# EAGLE schematic 408_jetracer_ledappend_boardRev010100 (EAGLE 9.6.2)
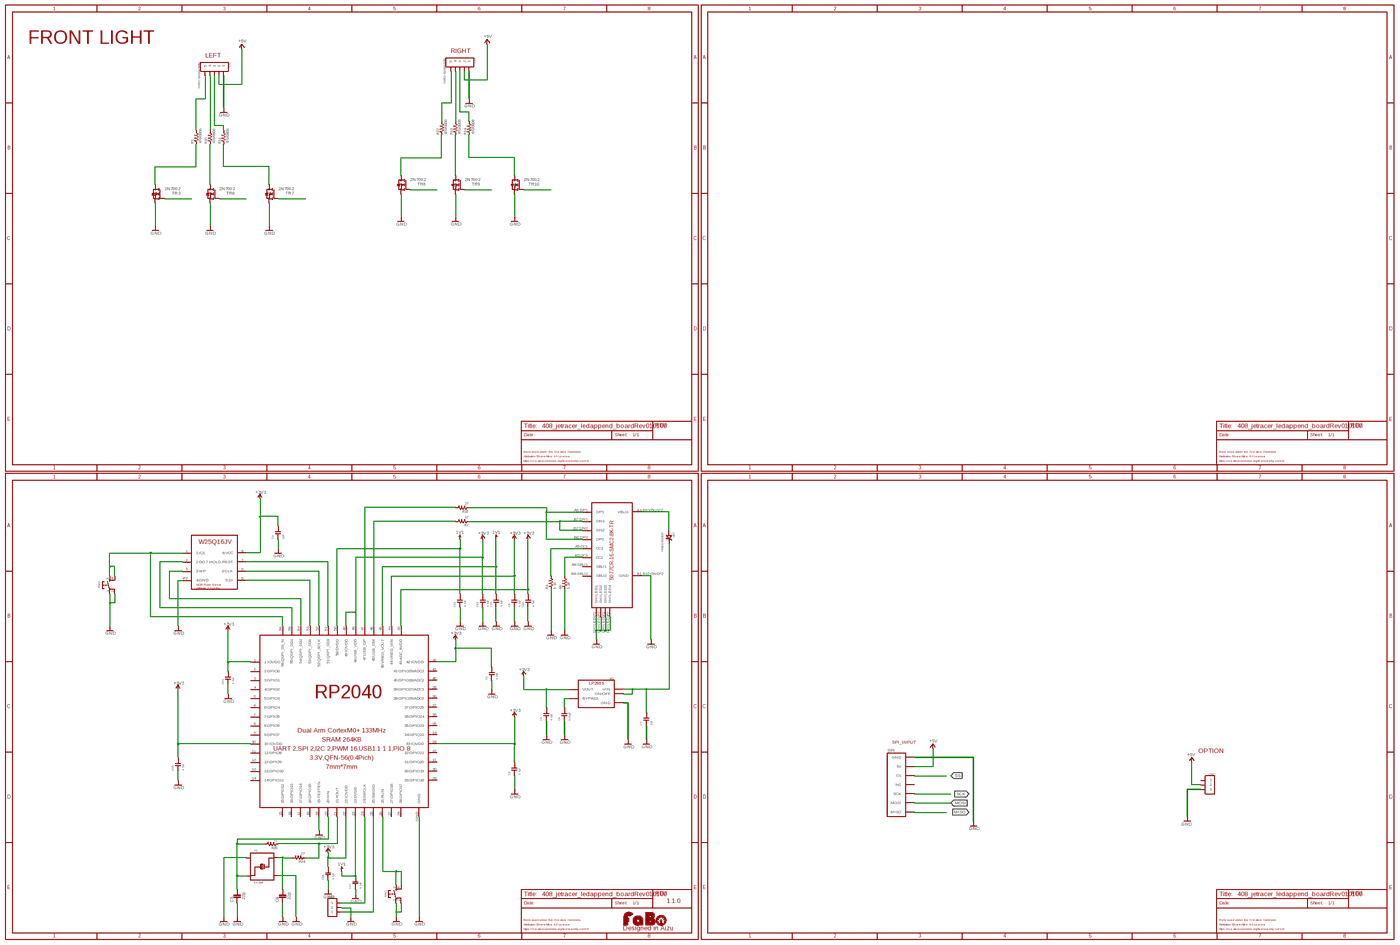
[diagram p0: schematic, sheet 1, overview]
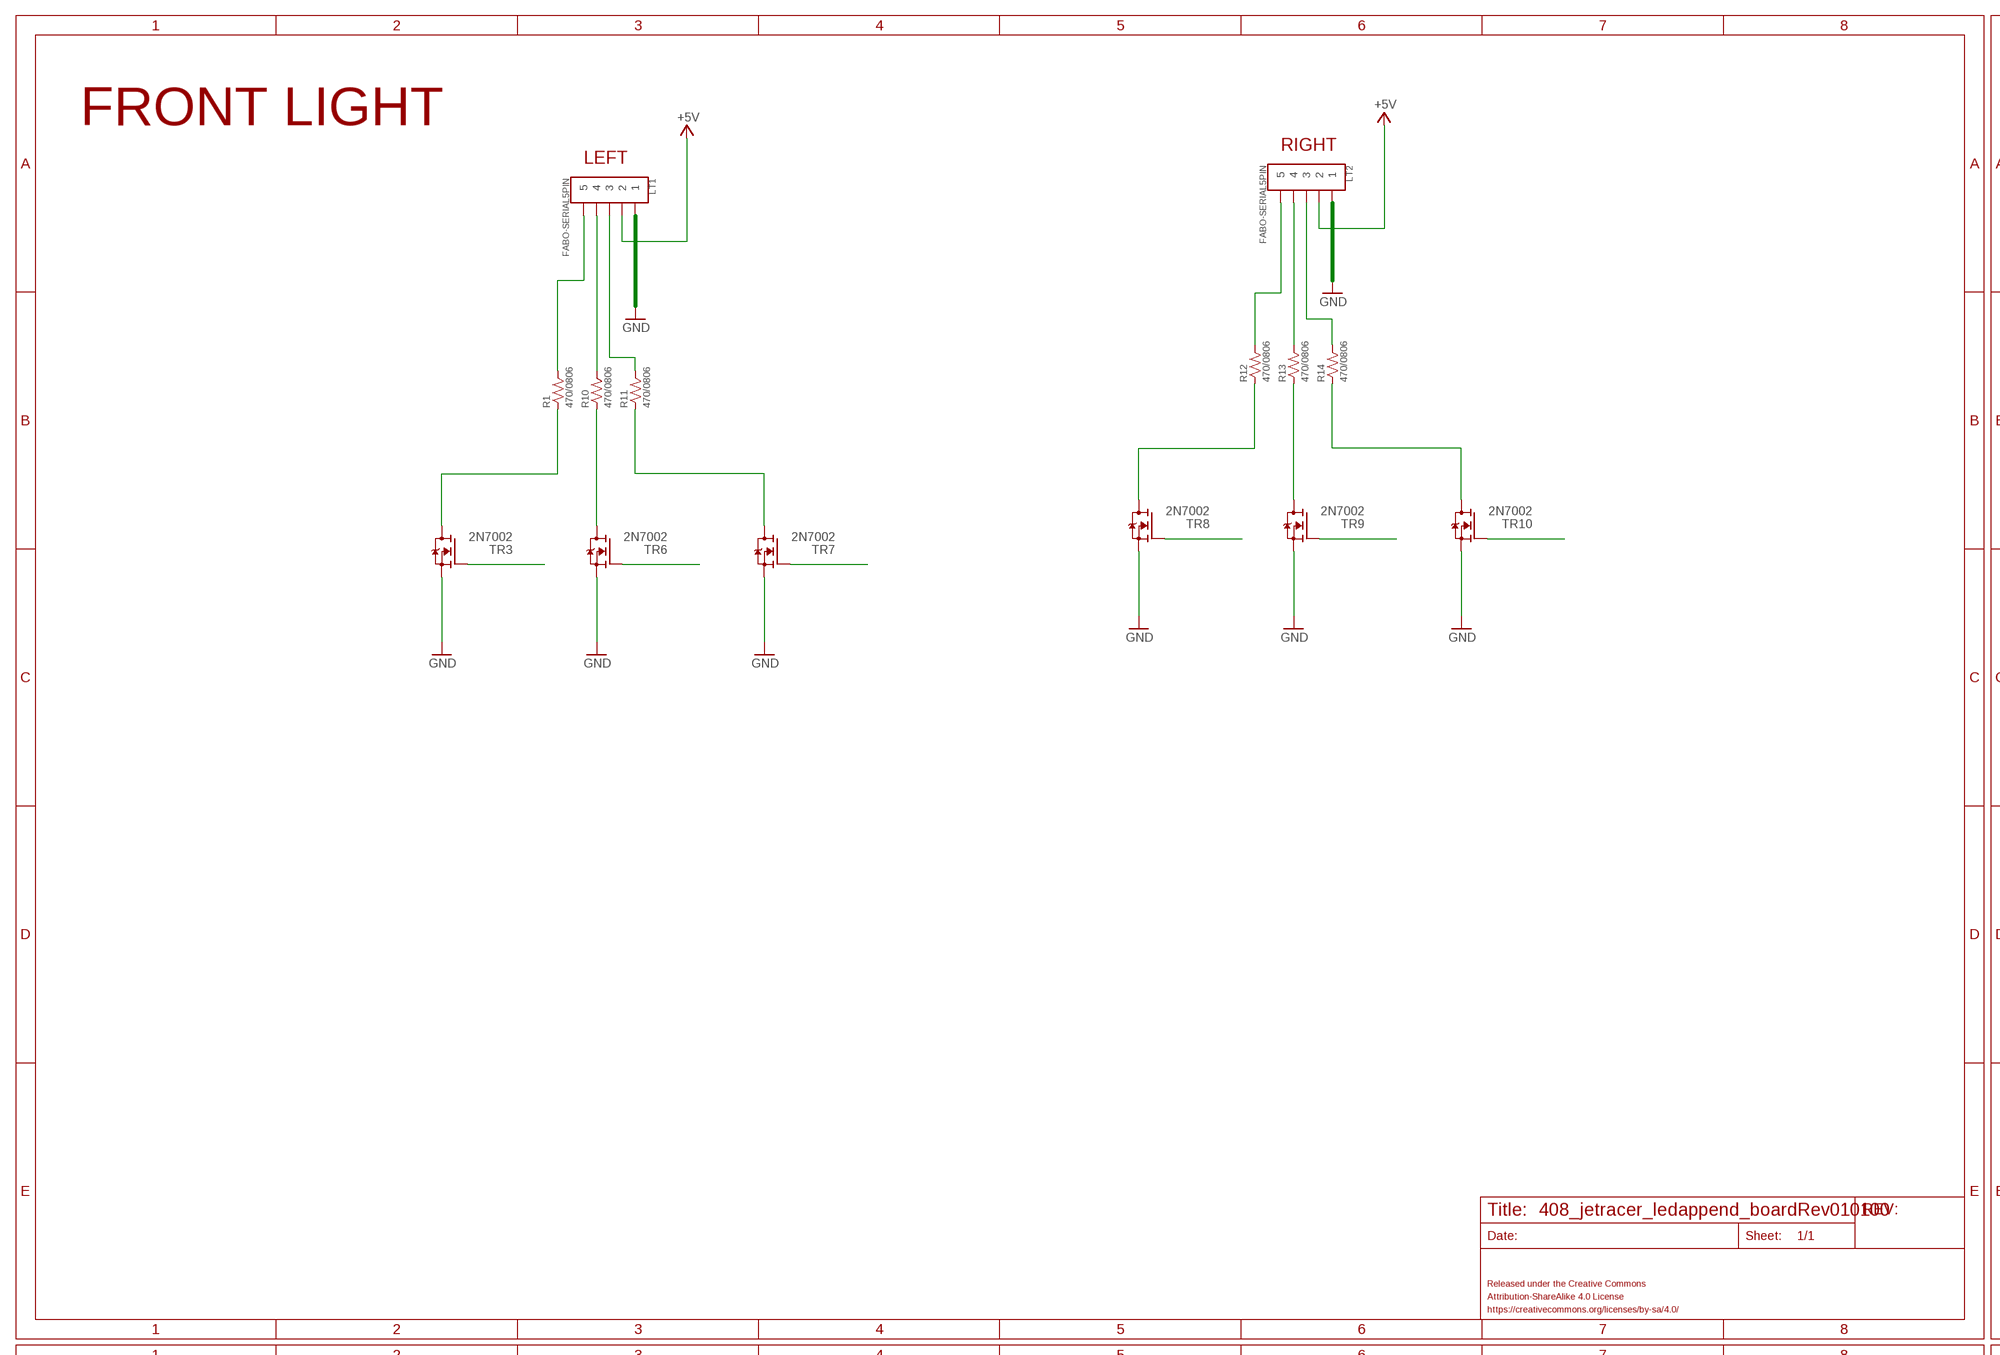
[diagram p1: schematic, sheet 1, part 1 of 4]
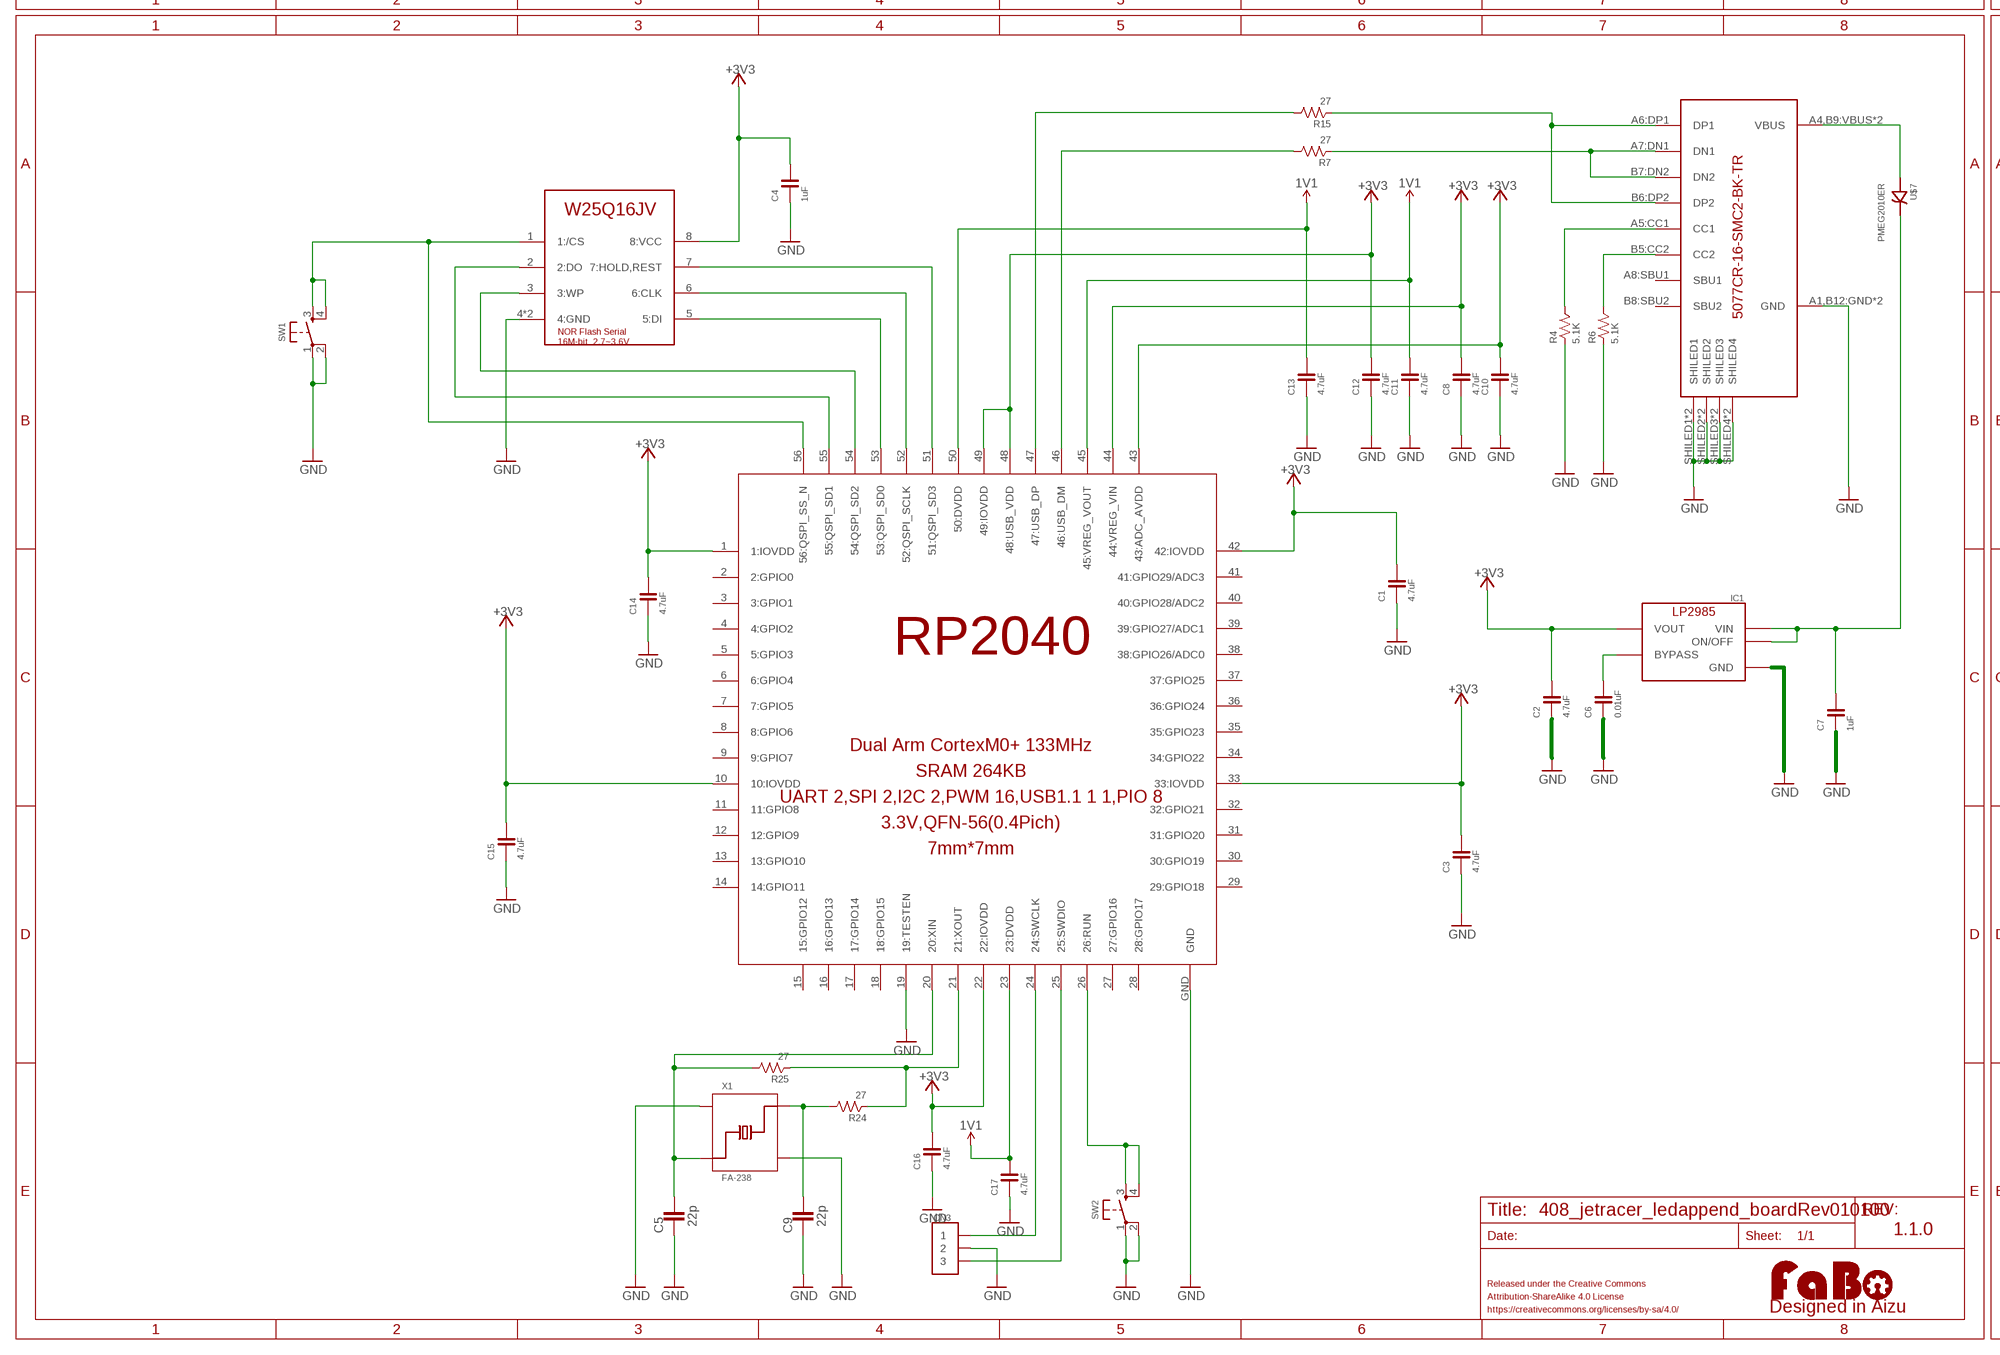
[diagram p2: schematic, sheet 1, part 2 of 4]
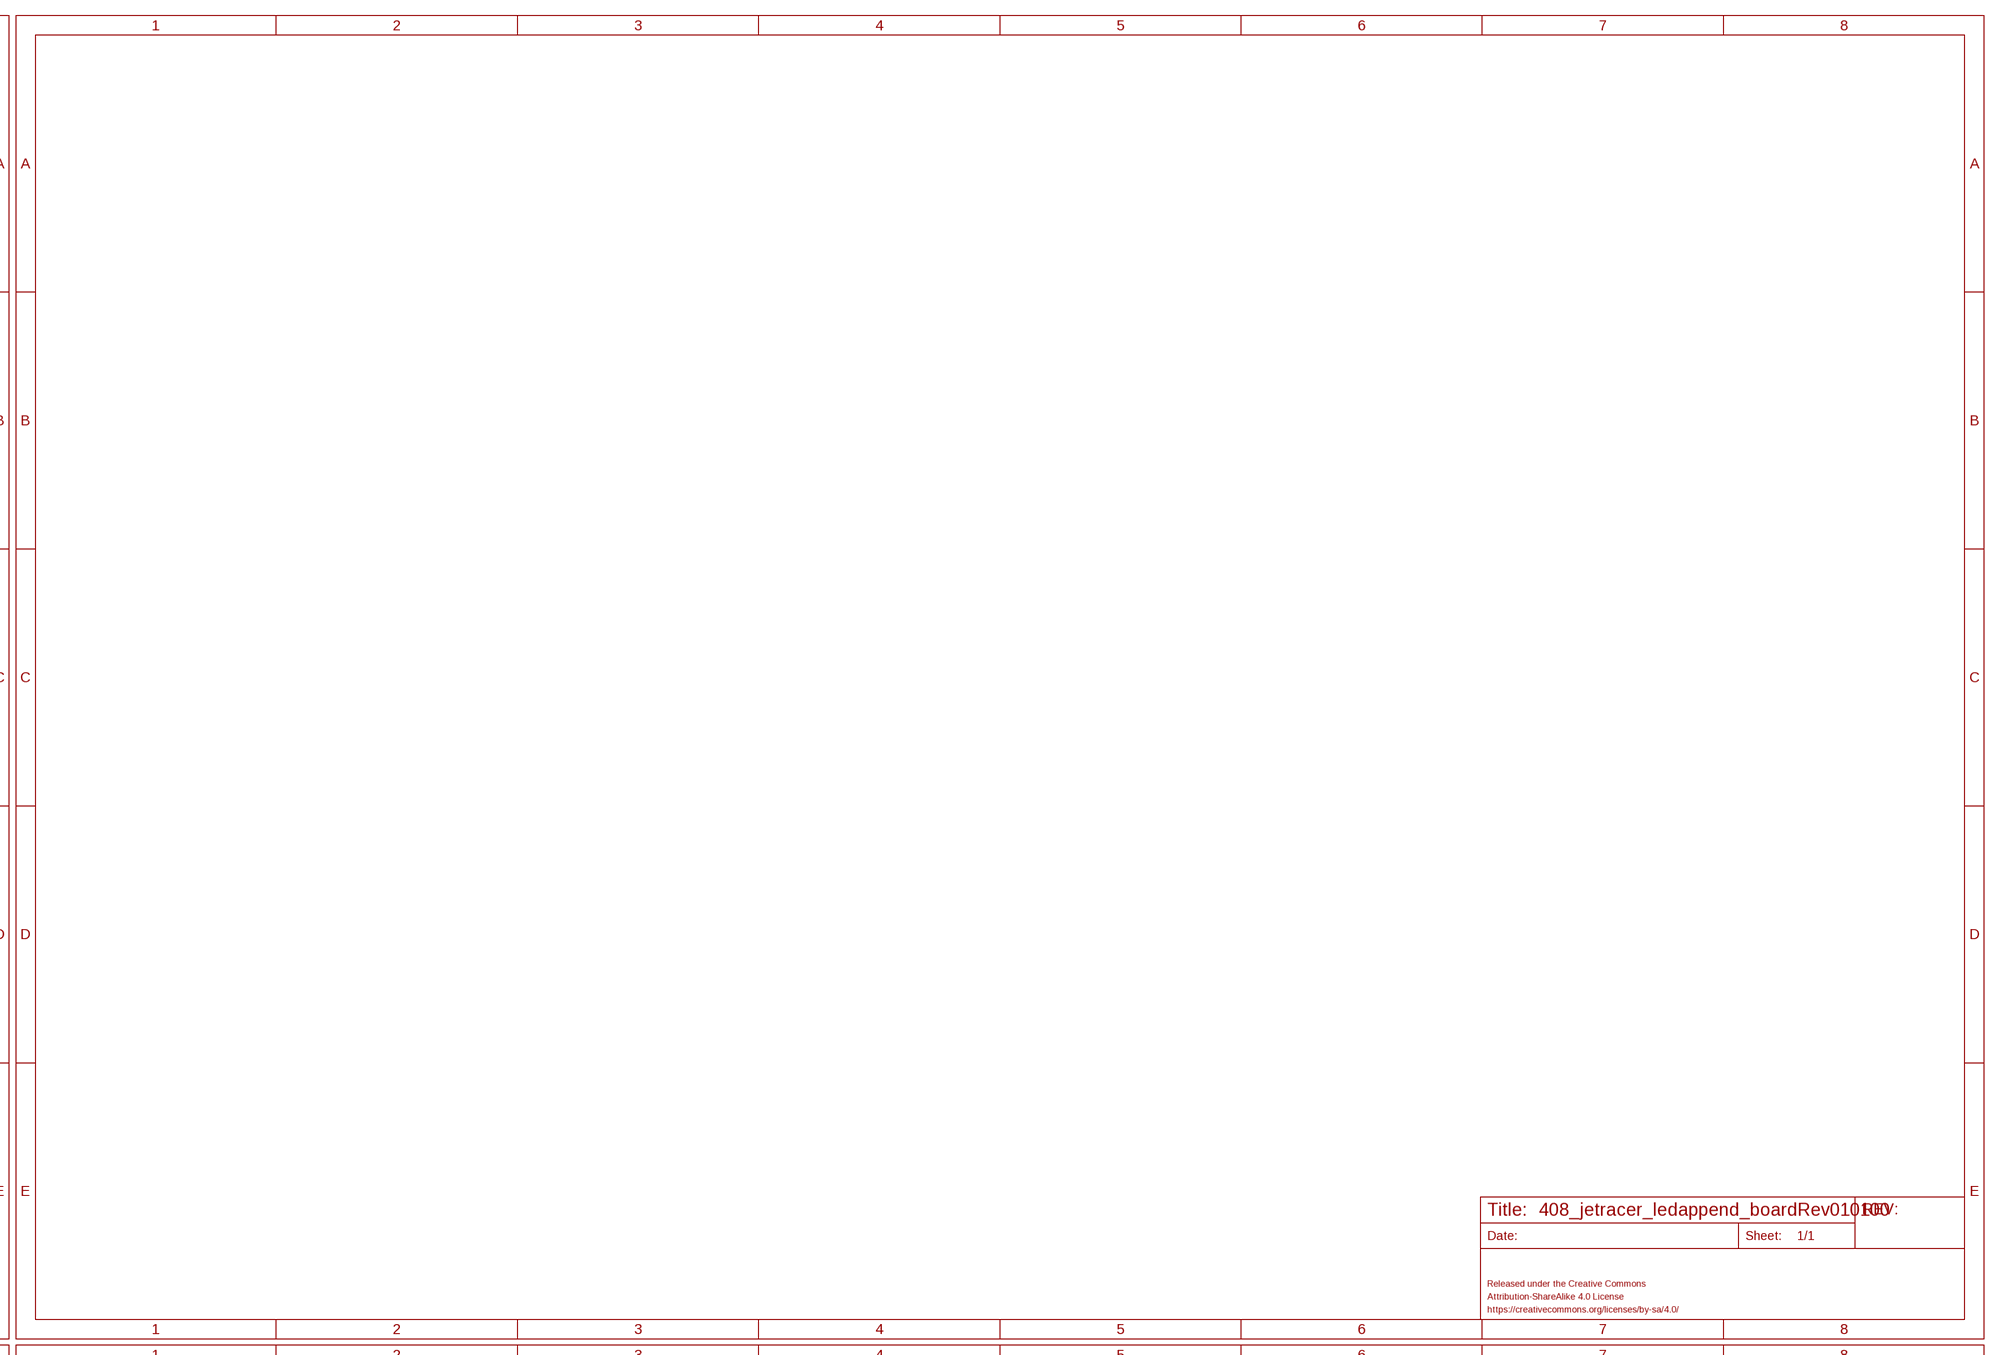
[diagram p3: schematic, sheet 1, part 3 of 4]
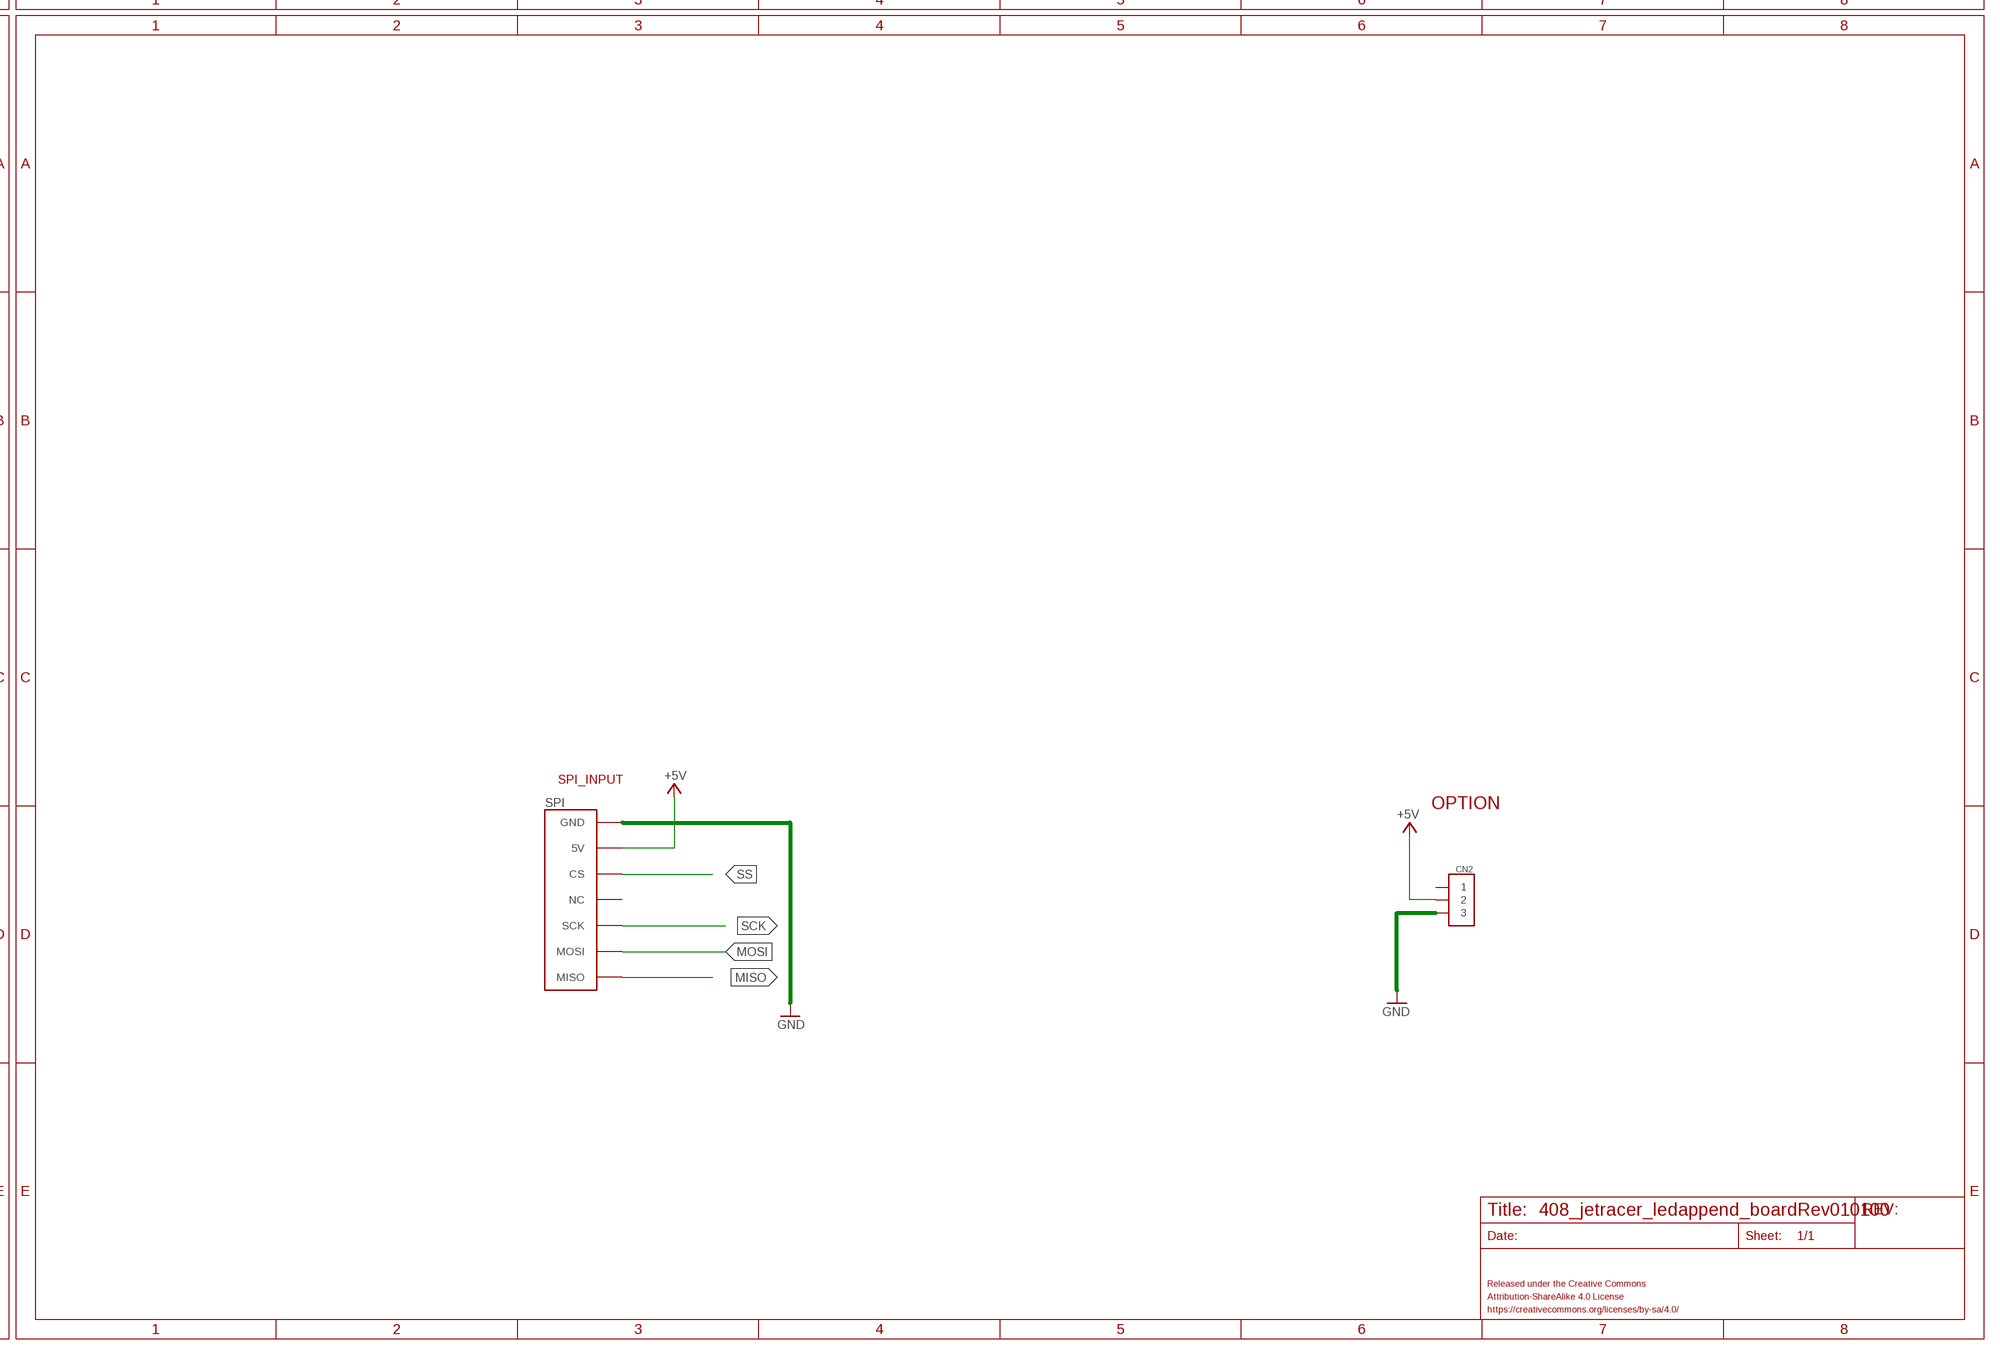
[diagram p4: schematic, sheet 1, part 4 of 4]

## Parts
C1  4.7uF  CAPACITOR-0603  [0603]
C2  4.7uF  CAPACITOR-0603  [0603]
C3  4.7uF  CAPACITOR-0603  [0603]
C4  1uF  CAPACITOR-0603  [0603]
C5  22p  0014_22PF_0603  [C0603-ROUND]
C6  0.01uF  CAPACITOR-0603  [0603]
C7  1uF  CAPACITOR-0603  [0603]
C8  4.7uF  CAPACITOR-0603  [0603]
C9  22p  0014_22PF_0603  [C0603-ROUND]
C10  4.7uF  CAPACITOR-0603  [0603]
C11  4.7uF  CAPACITOR-0603  [0603]
C12  4.7uF  CAPACITOR-0603  [0603]
C13  4.7uF  CAPACITOR-0603  [0603]
C14  4.7uF  CAPACITOR-0603  [0603]
C15  4.7uF  CAPACITOR-0603  [0603]
C16  4.7uF  CAPACITOR-0603  [0603]
C17  4.7uF  CAPACITOR-0603  [0603]
CN2  PIN_1X3  [PIN_1X3]
CN3  PIN_1X3  [PIN_1X3]
IC1  LP2985-33DBV  [SOT-23-5]
LOGO2  LOGO_FABO-M_BOTTOM  [LOGO_FABO_M_BOTTOM]
LT1  FABO-SERIAL5PIN  [BM05B-PASS-1]
LT2  FABO-SERIAL5PIN  [BM05B-PASS-1]
R1  470/0806  RESISTOR-0805  [0805]
R4  5.1K  RESISTOR-0603  [0603]
R6  5.1K  RESISTOR-0603  [0603]
R7  27  RESISTOR-0603  [0603]
R10  470/0806  RESISTOR-0805  [0805]
R11  470/0806  RESISTOR-0805  [0805]
R12  470/0806  RESISTOR-0805  [0805]
R13  470/0806  RESISTOR-0805  [0805]
R14  470/0806  RESISTOR-0805  [0805]
R15  27  RESISTOR-0603  [0603]
R24  27  RESISTOR-0603  [0603]
R25  27  RESISTOR-0603  [0603]
SPI  FABO-7PINMULTI_SPI  [BM07B-PASS-1]
SW1  TACT-SWITCH-SMD_KMR2  [KMR2]
SW2  TACT-SWITCH-SMD_KMR2  [KMR2]
TR3  2N7002  1612_2N7002LT1G  [SOT-23]
TR6  2N7002  1612_2N7002LT1G  [SOT-23]
TR7  2N7002  1612_2N7002LT1G  [SOT-23]
TR8  2N7002  1612_2N7002LT1G  [SOT-23]
TR9  2N7002  1612_2N7002LT1G  [SOT-23]
TR10  2N7002  1612_2N7002LT1G  [SOT-23]
U$2  RP2040  [RP2040]
U$4  W25Q16JVZPIM  [WSON8]
U$6  5077CR-16-SMC2-BK-TR  [5077CR-16-SMC2-BK-TR]
U$7  PMEG2010ER  [SOD123W]
X1  FA-238  [FA-238]

## Nets
1V8: C11.2 C13.2 C17.2 U$2.23(23:DVDD) U$2.45(45:VREG_VOUT) U$2.50(50:DVDD) ; supply symbol labelled 1V1
+3V3: C1.2 C2.2 C3.2 C4.2 C8.2 C10.2 C12.2 C14.2 C15.2 C16.2 IC1.5(VOUT) U$2.1(1:IOVDD) U$2.10(10:IOVDD) U$2.22(22:IOVDD) U$2.33(33:IOVDD) U$2.42(42:IOVDD) U$2.43(43:ADC_AVDD) U$2.44(44:VREG_VIN) U$2.48(48:USB_VDD) U$2.49(49:IOVDD) U$4.8(8:VCC)
+5V [usbvcc]: CN2.2 LT1.2 LT2.2 SPI.2(5V)
GND [gnd]: C1.1 C2.1 C3.1 C4.1 C5.1 C6.1 C7.1 C8.1 C9.1 C10.1 C11.1 C12.1 C13.1 C14.1 C15.1 C16.1 C17.1 CN2.3 CN3.2 IC1.2(GND) LT1.1 LT2.1 R4.1 R6.1 SPI.1(GND) SW1.1 SW1.2 SW2.1 SW2.2 TR3.2(S) TR6.2(S) TR7.2(S) TR8.2(S) TR9.2(S) TR10.2(S) U$2.19(19:TESTEN) U$2.GND U$4.4(4:GND) U$4.PAD(4:GND) U$6.A1,B12:GND(GND) U$6.B1,A12:GND(GND) U$6.SHILED1 U$6.SHILED2 U$6.SHILED3 U$6.SHILED4 U$6.SHILED5(SHILED1) U$6.SHILED6(SHILED2) U$6.SHILED7(SHILED3) U$6.SHILED8(SHILED4) X1.2(#2) X1.4(#4)
MISO: SPI.7(MISO)
MOSI: SPI.6(MOSI)
N$1: R13.1 TR9.1(D)
N$2: R10.1 TR6.1(D)
N$3: R1.1 TR3.1(D)
N$4: U$2.51(51:QSPI_SD3) U$4.7(7:HOLD,REST)
N$5: R11.1 TR7.1(D)
N$6: LT1.5 R1.2
N$7: C6.2 IC1.4(BYPASS)
N$8: R12.1 TR8.1(D)
N$9: LT1.4 R10.2
N$10: TR3.3(G) TR6.3(G) TR7.3(G) TR8.3(G) TR9.3(G) TR10.3(G)
N$11: LT1.3 R11.2
N$12: LT2.5 R12.2
N$13: LT2.4 R13.2
N$14: LT2.3 R14.2
N$15: R14.1 TR10.1(D)
N$29: U$2.52(52:QSPI_SCLK) U$4.6(6:CLK)
N$30: U$2.53(53:QSPI_SD0) U$4.5(5:DI)
N$32 [usbvcc]: C7.2 IC1.1(VIN) IC1.3(ON/OFF) U$7.1(CATHODE)
N$35: U$2.54(54:QSPI_SD2) U$4.3(3:WP)
N$36: U$2.55(55:QSPI_SD1) U$4.2(2:DO)
N$37: SW1.3 SW1.4 U$2.56(56:QSPI_SS_N) U$4.1(1:/CS)
N$38: R7.2 U$2.46(46:USB_DM)
N$39: R15.2 U$2.47(47:USB_DP)
N$40: R4.2 U$6.A5:CC1(CC1)
N$41: R6.2 U$6.B5:CC2(CC2)
N$42: SW2.3 SW2.4 U$2.26(26:RUN)
N$43: R15.1 U$6.A6:DP1(DP1) U$6.B6:DP2(DP2)
N$44: R7.1 U$6.A7:DN1(DN1) U$6.B7:DN2(DN2)
N$45: C9.2 R24.2 X1.3(#3)
N$46: C5.2 R25.2 U$2.20(20:XIN) X1.1(#1)
N$47: CN3.1 U$2.24(24:SWCLK)
N$48: R24.1 R25.1 U$2.21(21:XOUT)
N$49: CN3.3 U$2.25(25:SWDIO)
SCK: SPI.5(SCK)
SS: SPI.3(CS)
VBUS: U$6.A4,B9:VBUS(VBUS) U$6.B4,A9:VBUS(VBUS) U$7.2(ANODE)
Unconnected: CN2.1 SPI.4(NC) U$2.2(2:GPIO0) U$2.3(3:GPIO1) U$2.4(4:GPIO2) U$2.5(5:GPIO3) U$2.6(6:GPIO4) U$2.7(7:GPIO5) U$2.8(8:GPIO6) U$2.9(9:GPIO7) U$2.11(11:GPIO8) U$2.12(12:GPIO9) U$2.13(13:GPIO10) U$2.14(14:GPIO11) U$2.15(15:GPIO12) U$2.16(16:GPIO13) U$2.17(17:GPIO14) U$2.18(18:GPIO15) U$2.27(27:GPIO16) U$2.28(28:GPIO17) U$2.29(29:GPIO18) U$2.30(30:GPIO19) U$2.31(31:GPIO20) U$2.32(32:GPIO21) U$2.34(34:GPIO22) U$2.35(35:GPIO23) U$2.36(36:GPIO24) U$2.37(37:GPIO25) U$2.38(38:GPIO26/ADC0) U$2.39(39:GPIO27/ADC1) U$2.40(40:GPIO28/ADC2) U$2.41(41:GPIO29/ADC3) U$6.A8:SBU1(SBU1) U$6.B8:SBU2(SBU2)

## Notes on the sheet
- FRONT LIGHT
- RIGHT
- LEFT
- SPI_INPUT
- OPTION
- 1.1.0

## Library data of the parts
C1-C4 C6-C8 C10-C17 = FaBo-Capacitor:CAPACITOR: CAPACITOR
C5 C9 = Condensatori:0014_22PF_0603: 22pF 0603; CASE: 0603; MONTHLY_USAGE: _____; PART_NUMBER: 22pF_0603; PRICE: _____; SUPPLIER: _____; TYPE: Condensatori
CN2 CN3 = FaBo-PIN:PIN_1X3
IC1 = FaBo-Supply:LP2985: LP2985
LOGO2 = FaBo-Logo:LOGO_FABO
LT1 LT2 = FaBo-Connetor:FABO-SERIAL5PIN
R1 R4 R6 R7 R10-R15 R24 R25 = FaBo-Resistors:RESISTOR: RESISTOR
SPI = FaBo-Connetor:FABO-7PINMULTI_SPI
SW1 SW2 = FaBo-Switch:TACT-SWITCH: Part No Maker Datasheet Distributor 1273HA-160G-G SWITRONIC Catalog <http://www.switronic.com/uploads/images/A10.gif> Akizuki <http://akizukidenshi.com/catalog/g/gP-02561/> DTS-6-V Cosland DTS 6 Series <http://www.cosland.com/newproduct/DTS%20SERIES.pdf> Akizuki <http://akizukidenshi.com/catalog/g/gP-03647/> KMR2 C&K KMR2 SERIES <https://www.ckswitches.com/products/switches/product-details/Tactile/KMR2/> Octoparts Result <https://octopart.com/search?q=KMR2&start=0> TSHA-T-XB2-19E TOP UP INDUSTORY TSHA-T <http://www.top-up.com.tw/front/bin/ptdetail.phtml?Part=TSHA-T> Akizuki <http://akizukidenshi.com/catalog/g/gP-09361/>
TR3 TR6-TR10 = Transistors:1612_2N7002LT1G: 2N7002 60 V, 300 mA N-channel Trench MOSFET
U$2 = FaBo-MPU:RP2040
U$4 = FaBo-NORFLASH:W25Q16JVZPIM
U$6 = FaBo-USB:5077CR-16-SMC2-BK-TR
U$7 = FaBo-Diode:PMEG2010ER
X1 = FaBo-Crystal:FA-238

## Net classes
0 default: width 0.203 mm, drill 0.406 mm, clearance 0.203 mm
1 USB: width 0.203 mm, drill 0.305 mm, clearance 0.178 mm
2 gnd: width 0.254 mm, drill 0.254 mm, clearance 0.178 mm
3 usbvcc: width 0.203 mm, drill 0.406 mm, clearance 0.178 mm
4 USBpair: width 0.254 mm, drill 0.406 mm, clearance 0.406 mm